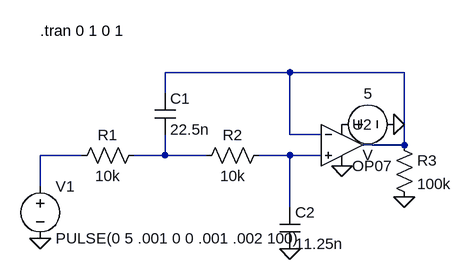
[diagram p0: schematic active LPF sallen-key.asc]
active LPF sallen-key.asc, the LTspice schematic file:
Version 4
SHEET 1 880 680
WIRE 384 -80 192 -80
WIRE 560 -80 384 -80
WIRE 192 -48 192 -80
WIRE 384 16 384 -80
WIRE 432 16 384 16
WIRE 560 32 560 -80
WIRE 560 32 496 32
WIRE 64 48 0 48
WIRE 192 48 192 16
WIRE 192 48 144 48
WIRE 256 48 192 48
WIRE 384 48 336 48
WIRE 432 48 384 48
WIRE 0 96 0 48
WIRE 384 128 384 48
FLAG 384 192 0
FLAG 0 176 0
FLAG 560 112 0
FLAG 464 64 0
FLAG 544 0 0
SYMBOL res 160 32 R90
WINDOW 0 0 56 VBottom 2
WINDOW 3 32 56 VTop 2
SYMATTR InstName R1
SYMATTR Value 10k
SYMBOL res 352 32 R90
WINDOW 0 0 56 VBottom 2
WINDOW 3 32 56 VTop 2
SYMATTR InstName R2
SYMATTR Value 10k
SYMBOL cap 176 -48 R0
SYMATTR InstName C1
SYMATTR Value 22.5n
SYMBOL cap 368 128 R0
SYMATTR InstName C2
SYMATTR Value 11.25n
SYMBOL voltage 0 80 R0
WINDOW 123 0 0 Left 0
WINDOW 39 0 0 Left 0
SYMATTR InstName V1
SYMATTR Value PULSE(0 5 .001 0 0 .001 .002 100)
SYMBOL res 544 16 R0
SYMATTR InstName R3
SYMATTR Value 100k
SYMBOL OpAmps\\OP07 464 -32 R0
SYMATTR InstName U2
SYMBOL voltage 448 0 R270
WINDOW 0 32 56 VTop 2
WINDOW 3 -32 56 VBottom 2
SYMATTR InstName 5
TEXT 0 -144 Left 2 !.tran 0 1 0 1

The netlist it stands for:
* active LPF sallen-key.asc
R1 N003 N002 10k
R2 N004 N003 10k
C1 N001 N003 22.5n
C2 N004 0 11.25n
V1 N002 0 PULSE(0 5 .001 0 0 .001 .002 100)
R3 N001 0 100k
XU2 N004 N001 P001 0 N001 LT1001  ; OP07, pins In+ In- V+ V- OUT
V§5 P001 0 V
.tran 0 1 0 1
.lib LTC.lib
.backanno
.end